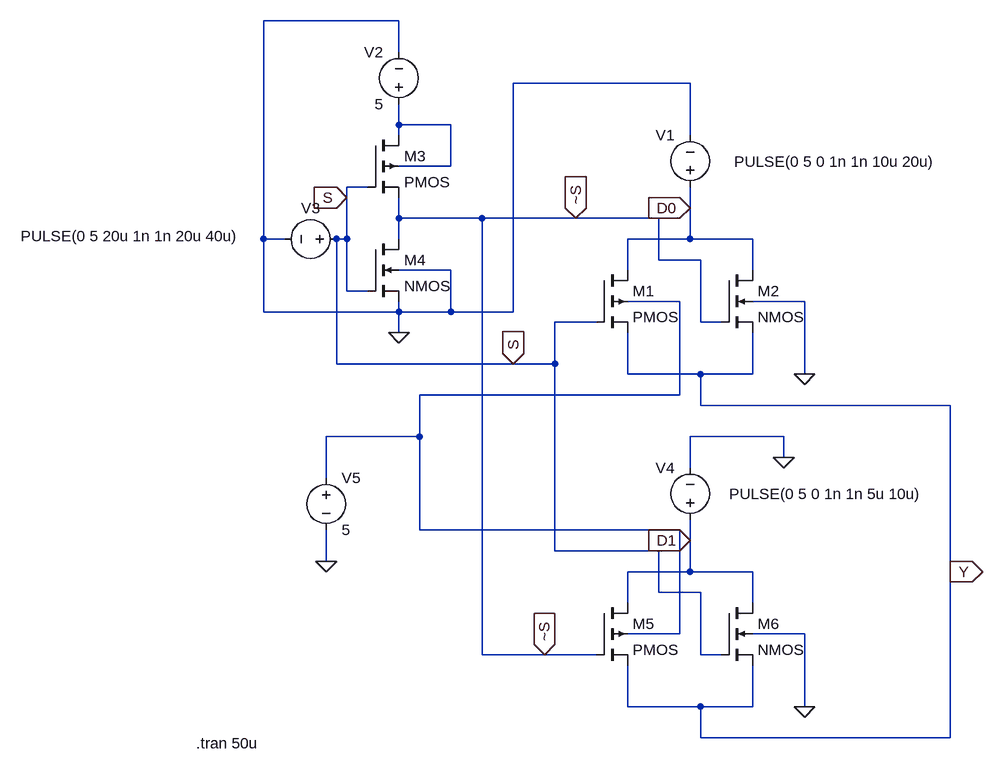
[diagram p0: schematic 2to1_TG_Mux.asc]
2to1_TG_Mux.asc, the LTspice schematic file:
Version 4.1
SHEET 1 880 872
WIRE -208 -256 -416 -256
WIRE -208 -208 -208 -256
WIRE 240 -160 -32 -160
WIRE -208 -96 -208 -128
WIRE -128 -96 -208 -96
WIRE -208 -80 -208 -96
WIRE 240 -80 240 -160
WIRE -128 -32 -128 -96
WIRE -128 -32 -208 -32
WIRE -256 0 -288 0
WIRE -288 16 -288 0
WIRE 240 32 240 0
WIRE -208 48 -208 16
WIRE -80 48 -208 48
WIRE 64 48 -80 48
WIRE 192 48 64 48
WIRE -416 80 -416 -256
WIRE -384 80 -416 80
WIRE -288 80 -288 16
WIRE -288 80 -304 80
WIRE -208 80 -208 48
WIRE 240 80 240 32
WIRE 240 80 144 80
WIRE 336 80 240 80
WIRE 192 112 192 48
WIRE 256 112 192 112
WIRE -128 128 -208 128
WIRE 144 128 144 80
WIRE 336 128 336 80
WIRE -288 160 -288 80
WIRE -256 160 -288 160
WIRE 224 176 144 176
WIRE 416 176 336 176
WIRE -416 192 -416 80
WIRE -208 192 -208 176
WIRE -208 192 -416 192
WIRE -128 192 -128 128
WIRE -128 192 -208 192
WIRE -32 192 -32 -160
WIRE -32 192 -128 192
WIRE 96 208 32 208
WIRE 256 208 256 112
WIRE 288 208 256 208
WIRE -208 224 -208 192
WIRE -304 272 -304 80
WIRE -32 272 -304 272
WIRE 32 272 32 208
WIRE 32 272 -32 272
WIRE 144 288 144 224
WIRE 256 288 144 288
WIRE 336 288 336 224
WIRE 336 288 256 288
WIRE 416 288 416 176
WIRE 224 320 224 176
WIRE 224 320 -176 320
WIRE 256 336 256 288
WIRE 640 336 256 336
WIRE -176 384 -176 320
WIRE -176 384 -320 384
WIRE 384 384 240 384
WIRE 384 416 384 384
WIRE 240 432 240 384
WIRE -320 448 -320 384
WIRE -176 528 -176 384
WIRE 224 528 -176 528
WIRE 240 544 240 512
WIRE 32 560 32 272
WIRE 192 560 32 560
WIRE -320 576 -320 528
WIRE 240 592 240 544
WIRE 240 592 144 592
WIRE 336 592 240 592
WIRE 640 592 640 336
WIRE 192 624 192 560
WIRE 256 624 192 624
WIRE 144 640 144 592
WIRE 336 640 336 592
WIRE 224 688 224 528
WIRE 224 688 144 688
WIRE 416 688 336 688
WIRE -80 720 -80 48
WIRE 16 720 -80 720
WIRE 96 720 16 720
WIRE 256 720 256 624
WIRE 288 720 256 720
WIRE 144 800 144 736
WIRE 256 800 144 800
WIRE 336 800 336 736
WIRE 336 800 256 800
WIRE 416 800 416 688
WIRE 256 848 256 800
WIRE 640 848 640 592
WIRE 640 848 256 848
FLAG -208 224 0
FLAG 384 416 0
FLAG 640 592 Y
IOPIN 640 592 Out
FLAG 240 32 D0
IOPIN 240 32 In
FLAG 240 544 D1
IOPIN 240 544 In
FLAG -288 16 S
IOPIN -288 16 In
FLAG 64 48 ~S
IOPIN 64 48 In
FLAG 16 720 ~S
IOPIN 16 720 In
FLAG -32 272 S
IOPIN -32 272 In
FLAG 416 800 0
FLAG 416 288 0
FLAG -320 576 0
SYMBOL pmos4 96 128 R0
SYMATTR InstName M1
SYMBOL nmos4 288 128 R0
SYMATTR InstName M2
SYMBOL voltage 240 16 R180
WINDOW 0 24 96 Left 2
WINDOW 3 -378 55 Left 2
WINDOW 123 0 0 Left 0
WINDOW 39 0 0 Left 0
SYMATTR InstName V1
SYMATTR Value PULSE(0 5 0 1n 1n 10u 20u)
SYMBOL pmos4 -256 -80 R0
SYMATTR InstName M3
SYMBOL nmos4 -256 80 R0
SYMATTR InstName M4
SYMBOL voltage -288 80 R90
WINDOW 0 -32 56 VBottom 2
WINDOW 3 -20 333 VTop 2
WINDOW 123 0 0 Left 0
WINDOW 39 0 0 Left 0
SYMATTR InstName V3
SYMATTR Value PULSE(0 5 20u 1n 1n 20u 40u)
SYMBOL pmos4 96 640 R0
SYMATTR InstName M5
SYMBOL nmos4 288 640 R0
SYMATTR InstName M6
SYMBOL voltage 240 528 R180
WINDOW 0 24 96 Left 2
WINDOW 3 -357 56 Left 2
WINDOW 123 0 0 Left 0
WINDOW 39 0 0 Left 0
SYMATTR InstName V4
SYMATTR Value PULSE(0 5 0 1n 1n 5u 10u)
SYMBOL voltage -208 -112 R180
WINDOW 0 24 96 Left 2
WINDOW 3 24 16 Left 2
WINDOW 123 0 0 Left 0
WINDOW 39 0 0 Left 0
SYMATTR InstName V2
SYMATTR Value 5
SYMBOL voltage -320 432 R0
WINDOW 123 0 0 Left 0
WINDOW 39 0 0 Left 0
SYMATTR InstName V5
SYMATTR Value 5
TEXT -520 856 Left 2 !.tran 50u

The netlist it stands for:
* 2to1_TG_Mux.asc
M1 D0 S Y N002 PMOS
M2 D0 ~S Y 0 NMOS
V1 D0 0 PULSE(0 5 0 1n 1n 10u 20u)
M3 N001 S ~S N001 PMOS
M4 ~S S 0 0 NMOS
V3 S 0 PULSE(0 5 20u 1n 1n 20u 40u)
M5 D1 ~S Y N002 PMOS
M6 D1 S Y 0 NMOS
V4 D1 0 PULSE(0 5 0 1n 1n 5u 10u)
V2 N001 0 5
V5 N002 0 5
.model NMOS NMOS
.model PMOS PMOS
.lib standard.mos
.tran 50u
.backanno
.end